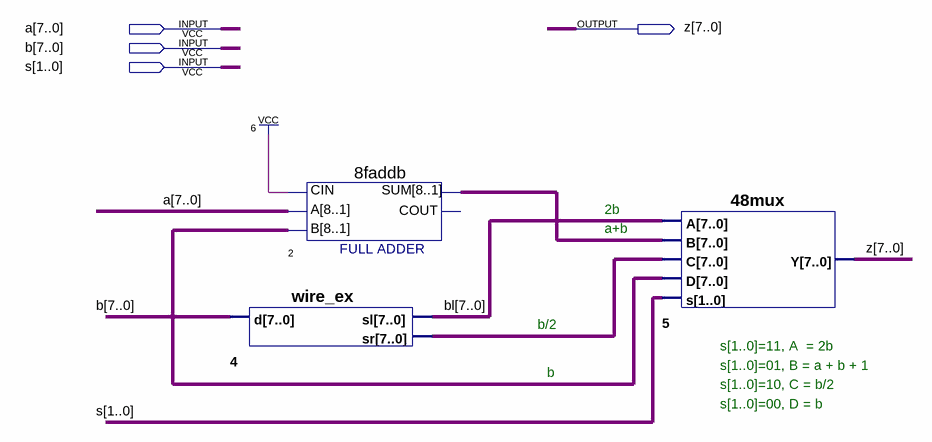
[diagram p0: schematic sheet]
// Quartus schematic alu_sp.bdf as structural Verilog: 3 symbols, 4 pins
module alu_sp (
  input  [7:0] a,
  input  [7:0] b,
  input  [1:0] s,
  output [7:0] z
);

  wire [7:0] bl, n2_sum, n4_sr;

  wire_ex u_4 (.d(b), .sl(bl), .sr(n4_sr));
  \8faddb  u_2 (.CIN(1'b1), .A(a), .B(b), .SUM(n2_sum));  // open: COUT
  \48mux  u_5 (.A(bl), .B(n2_sum), .C(n4_sr), .D(b), .s(s), .Y(z));

  // Notes on the sheet:
  //   2b
  //   a+b
  //   b/2
  //   s[1..0]=11, A  = 2b
  //   s[1..0]=01, B = a + b + 1
  //   b
  //   s[1..0]=10, C = b/2
  //   s[1..0]=00, D = b
endmodule
